# Altium project V72_A33.PrjPcb
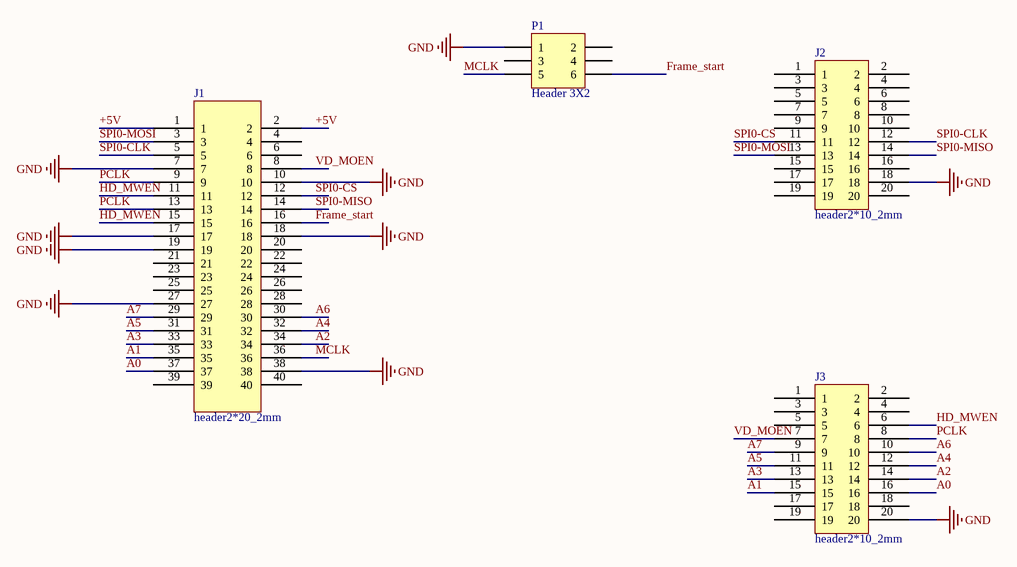
[diagram p0: V72_A33.SchDoc]
1 sheet, 4 parts. Net scope: global (net labels, ports and power ports of the same name join across sheets).
Board file: V72_A33.PcbDoc

## Sheet V72_A33.SchDoc
size A4

### Parts
J1  header2*20_2mm  [header2*20_2mm]
J2  header2*10_2mm  [header2*10_2mm]
J3  header2*10_2mm  [header2*10_2mm]
P1  Header 3X2  [HDR2X3]

### Nets
GND: J1.7 J1.10 J1.17 J1.18 J1.19 J1.27 J1.38 J2.18 J3.20 P1.1
+5V: J1.1 J1.2
A0: J1.37 J3.16
A1: J1.35 J3.15
A2: J1.34 J3.14
A3: J1.33 J3.13
A4: J1.32 J3.12
A5: J1.31 J3.11
A6: J1.30 J3.10
A7: J1.29 J3.9
Frame_start: J1.16 P1.6
HD_MWEN: J1.11 J1.15 J3.6
MCLK: J1.36 P1.5
PCLK: J1.9 J1.13 J3.8
SPI0-CLK: J1.5 J2.12
SPI0-CS: J1.12 J2.11
SPI0-MISO: J1.14 J2.14
SPI0-MOSI: J1.3 J2.13
VD_MOEN: J1.8 J3.7

Not connected (* = marked no-connect by the designer): J1 4 6 20 21 22 23 24 25 26 28 39 40; J2 1 2 3 4 5 6 7 8 9 10 15 16 17 19 20; J3 1 2 3 4 5 17 18 19; P1 2 3 4

### Library data of the parts
P1 = Header 3X2: Header, 3-Pin, Dual row; LatestRevisionDate: 17-Jul-2002; LatestRevisionNote: Re-released for DXP Platform.; Publisher: Altium Limited